# Altium schematic sheet 02_ZYNQ_CORE_POS.SchDoc
size 566 x 398 mm; SheetNumber: 2; SheetTotal: 7
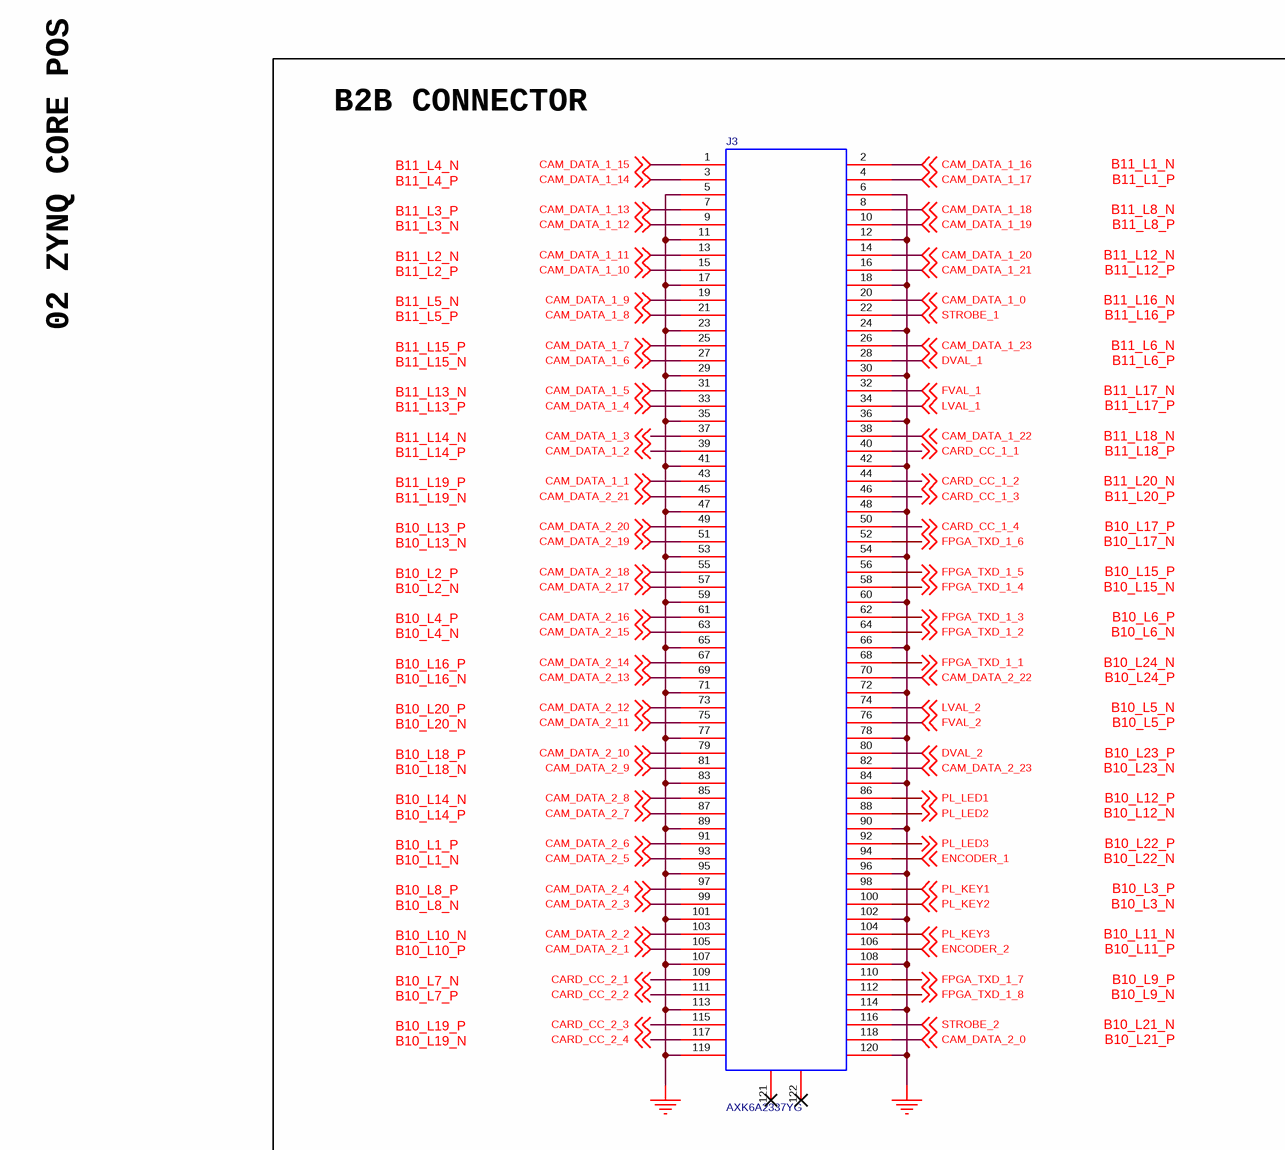
[diagram p0: 02_ZYNQ_CORE_POS.SchDoc, top left]
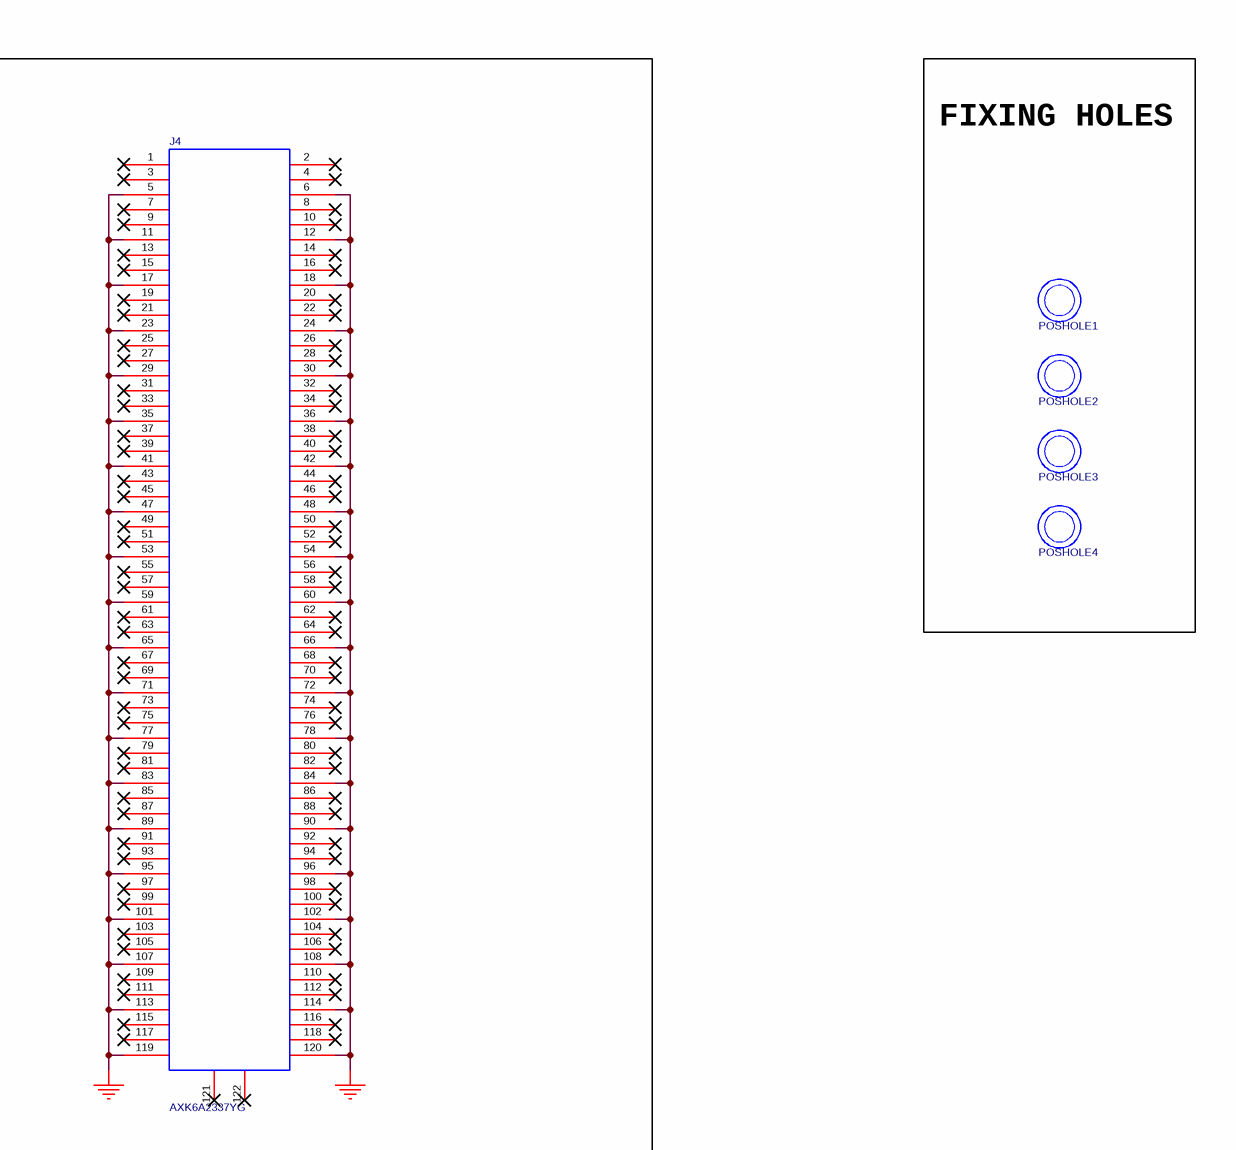
[diagram p1: 02_ZYNQ_CORE_POS.SchDoc, top right]
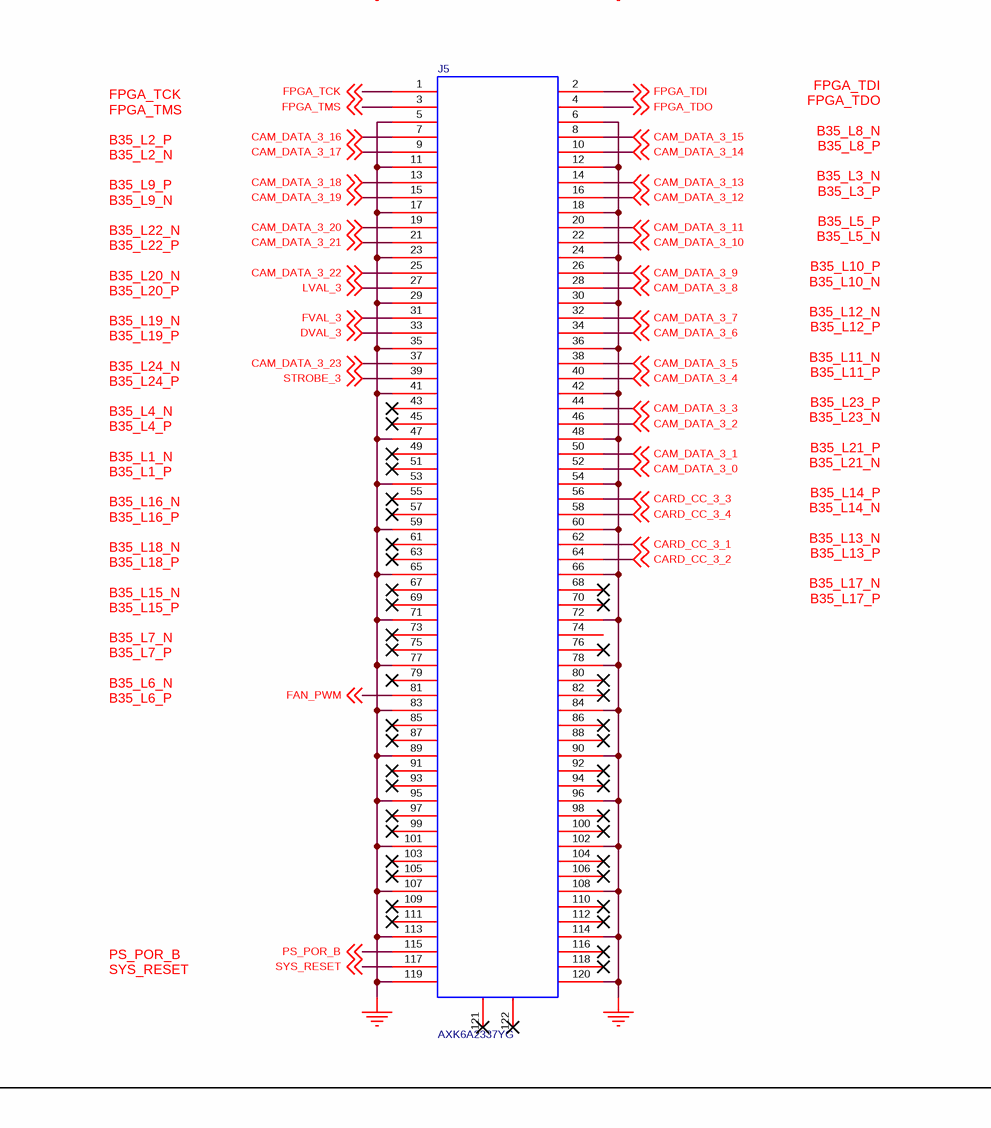
[diagram p2: 02_ZYNQ_CORE_POS.SchDoc, bottom left]
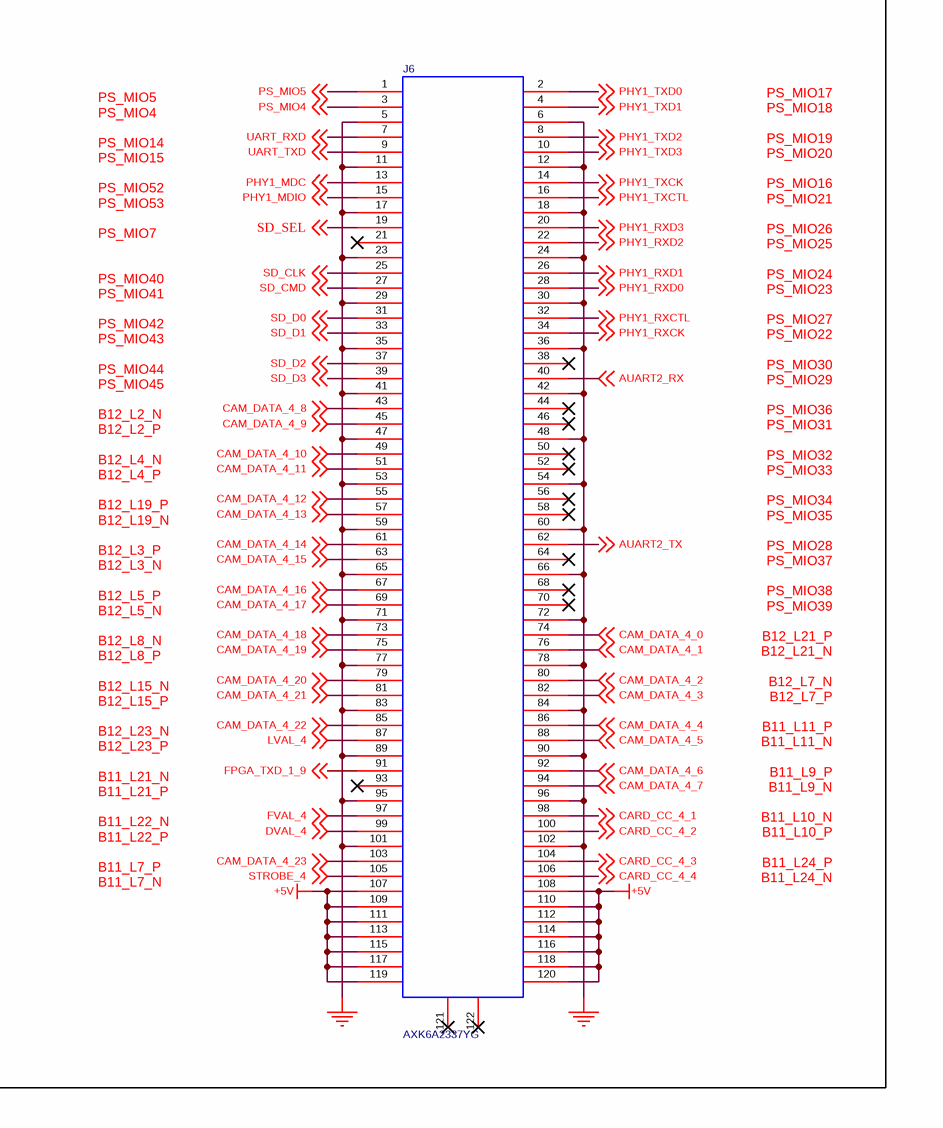
[diagram p3: 02_ZYNQ_CORE_POS.SchDoc, bottom right]

## Parts
J3  AXK6A2337YG  [AXK620337YG]
J4  AXK6A2337YG  [AXK620337YG]
J5  AXK6A2337YG  [AXK620337YG]
J6  AXK6A2337YG  [AXK620337YG]
POSHOLE1  POSHOLE  [POSHOLE-3.2]  (value not drawn)
POSHOLE2  POSHOLE  [POSHOLE-3.2]  (value not drawn)
POSHOLE3  POSHOLE  [POSHOLE-3.2]  (value not drawn)
POSHOLE4  POSHOLE  [POSHOLE-3.2]  (value not drawn)

## Blocks framed on the sheet
B2B CONNECTOR: J3-J6
FIXING HOLES: POSHOLE1-POSHOLE4

## Nets
+5V: J6.107 J6.108 J6.109 J6.110 J6.111 J6.112 J6.113 J6.114 J6.115 J6.116 J6.117 J6.118 J6.119 J6.120
GND: J3.5 J3.6 J3.11 J3.12 J3.17 J3.18 J3.23 J3.24 J3.29 J3.30 J3.35 J3.36 J3.41 J3.42 J3.47 J3.48 J3.53 J3.54 J3.59 J3.60 J3.65 J3.66 J3.71 J3.72 J3.77 J3.78 J3.83 J3.84 J3.89 J3.90 J3.95 J3.96 J3.101 J3.102 J3.107 J3.108 J3.113 J3.114 J3.119 J3.120 J4.5 J4.6 J4.11 J4.12 J4.17 J4.18 J4.23 J4.24 J4.29 J4.30 J4.35 J4.36 J4.41 J4.42 J4.47 J4.48 J4.53 J4.54 J4.59 J4.60 J4.65 J4.66 J4.71 J4.72 J4.77 J4.78 J4.83 J4.84 J4.89 J4.90 J4.95 J4.96 J4.101 J4.102 J4.107 J4.108 J4.113 J4.114 J4.119 J4.120 J5.5 J5.6 J5.11 J5.12 J5.17 J5.18 J5.23 J5.24 J5.29 J5.30 J5.35 J5.36 J5.41 J5.42 J5.47 J5.48 J5.53 J5.54 J5.59 J5.60 J5.65 J5.66 J5.71 J5.72 J5.77 J5.78 J5.83 J5.84 J5.89 J5.90 J5.95 J5.96 J5.101 J5.102 J5.107 J5.108 J5.113 J5.114 J5.119 J5.120 J6.5 J6.6 J6.11 J6.12 J6.17 J6.18 J6.23 J6.24 J6.29 J6.30 J6.35 J6.36 J6.41 J6.42 J6.47 J6.48 J6.53 J6.54 J6.59 J6.60 J6.65 J6.66 J6.71 J6.72 J6.77 J6.78 J6.83 J6.84 J6.89 J6.90 J6.95 J6.96 J6.101 J6.102
AUART2_RX: J6.40 ; off-sheet AUART2_RX
AUART2_TX: J6.62 ; off-sheet AUART2_TX
CAM_DATA_1_0: J3.20 ; off-sheet CAM_DATA_1_0
CAM_DATA_1_1: J3.43 ; off-sheet CAM_DATA_1_1
CAM_DATA_1_2: J3.39 ; off-sheet CAM_DATA_1_2
CAM_DATA_1_3: J3.37 ; off-sheet CAM_DATA_1_3
CAM_DATA_1_4: J3.33 ; off-sheet CAM_DATA_1_4
CAM_DATA_1_5: J3.31 ; off-sheet CAM_DATA_1_5
CAM_DATA_1_6: J3.27 ; off-sheet CAM_DATA_1_6
CAM_DATA_1_7: J3.25 ; off-sheet CAM_DATA_1_7
CAM_DATA_1_8: J3.21 ; off-sheet CAM_DATA_1_8
CAM_DATA_1_9: J3.19 ; off-sheet CAM_DATA_1_9
CAM_DATA_1_10: J3.15 ; off-sheet CAM_DATA_1_10
CAM_DATA_1_11: J3.13 ; off-sheet CAM_DATA_1_11
CAM_DATA_1_12: J3.9 ; off-sheet CAM_DATA_1_12
CAM_DATA_1_13: J3.7 ; off-sheet CAM_DATA_1_13
CAM_DATA_1_14: J3.3 ; off-sheet CAM_DATA_1_14
CAM_DATA_1_15: J3.1 ; off-sheet CAM_DATA_1_15
CAM_DATA_1_16: J3.2 ; off-sheet CAM_DATA_1_16
CAM_DATA_1_17: J3.4 ; off-sheet CAM_DATA_1_17
CAM_DATA_1_18: J3.8 ; off-sheet CAM_DATA_1_18
CAM_DATA_1_19: J3.10 ; off-sheet CAM_DATA_1_19
CAM_DATA_1_20: J3.14 ; off-sheet CAM_DATA_1_20
CAM_DATA_1_21: J3.16 ; off-sheet CAM_DATA_1_21
CAM_DATA_1_22: J3.38 ; off-sheet CAM_DATA_1_22
CAM_DATA_1_23: J3.26 ; off-sheet CAM_DATA_1_23
CAM_DATA_2_0: J3.118 ; off-sheet CAM_DATA_2_0
CAM_DATA_2_1: J3.105 ; off-sheet CAM_DATA_2_1
CAM_DATA_2_2: J3.103 ; off-sheet CAM_DATA_2_2
CAM_DATA_2_3: J3.99 ; off-sheet CAM_DATA_2_3
CAM_DATA_2_4: J3.97 ; off-sheet CAM_DATA_2_4
CAM_DATA_2_5: J3.93 ; off-sheet CAM_DATA_2_5
CAM_DATA_2_6: J3.91 ; off-sheet CAM_DATA_2_6
CAM_DATA_2_7: J3.87 ; off-sheet CAM_DATA_2_7
CAM_DATA_2_8: J3.85 ; off-sheet CAM_DATA_2_8
CAM_DATA_2_9: J3.81 ; off-sheet CAM_DATA_2_9
CAM_DATA_2_10: J3.79 ; off-sheet CAM_DATA_2_10
CAM_DATA_2_11: J3.75 ; off-sheet CAM_DATA_2_11
CAM_DATA_2_12: J3.73 ; off-sheet CAM_DATA_2_12
CAM_DATA_2_13: J3.69 ; off-sheet CAM_DATA_2_13
CAM_DATA_2_14: J3.67 ; off-sheet CAM_DATA_2_14
CAM_DATA_2_15: J3.63 ; off-sheet CAM_DATA_2_15
CAM_DATA_2_16: J3.61 ; off-sheet CAM_DATA_2_16
CAM_DATA_2_17: J3.57 ; off-sheet CAM_DATA_2_17
CAM_DATA_2_18: J3.55 ; off-sheet CAM_DATA_2_18
CAM_DATA_2_19: J3.51 ; off-sheet CAM_DATA_2_19
CAM_DATA_2_20: J3.49 ; off-sheet CAM_DATA_2_20
CAM_DATA_2_21: J3.45 ; off-sheet CAM_DATA_2_21
CAM_DATA_2_22: J3.70 ; off-sheet CAM_DATA_2_22
CAM_DATA_2_23: J3.82 ; off-sheet CAM_DATA_2_23
CAM_DATA_3_0: J5.52 ; off-sheet CAM_DATA_3_0
CAM_DATA_3_1: J5.50 ; off-sheet CAM_DATA_3_1
CAM_DATA_3_2: J5.46 ; off-sheet CAM_DATA_3_2
CAM_DATA_3_3: J5.44 ; off-sheet CAM_DATA_3_3
CAM_DATA_3_4: J5.40 ; off-sheet CAM_DATA_3_4
CAM_DATA_3_5: J5.38 ; off-sheet CAM_DATA_3_5
CAM_DATA_3_6: J5.34 ; off-sheet CAM_DATA_3_6
CAM_DATA_3_7: J5.32 ; off-sheet CAM_DATA_3_7
CAM_DATA_3_8: J5.28 ; off-sheet CAM_DATA_3_8
CAM_DATA_3_9: J5.26 ; off-sheet CAM_DATA_3_9
CAM_DATA_3_10: J5.22 ; off-sheet CAM_DATA_3_10
CAM_DATA_3_11: J5.20 ; off-sheet CAM_DATA_3_11
CAM_DATA_3_12: J5.16 ; off-sheet CAM_DATA_3_12
CAM_DATA_3_13: J5.14 ; off-sheet CAM_DATA_3_13
CAM_DATA_3_14: J5.10 ; off-sheet CAM_DATA_3_14
CAM_DATA_3_15: J5.8 ; off-sheet CAM_DATA_3_15
CAM_DATA_3_16: J5.7 ; off-sheet CAM_DATA_3_16
CAM_DATA_3_17: J5.9 ; off-sheet CAM_DATA_3_17
CAM_DATA_3_18: J5.13 ; off-sheet CAM_DATA_3_18
CAM_DATA_3_19: J5.15 ; off-sheet CAM_DATA_3_19
CAM_DATA_3_20: J5.19 ; off-sheet CAM_DATA_3_20
CAM_DATA_3_21: J5.21 ; off-sheet CAM_DATA_3_21
CAM_DATA_3_22: J5.25 ; off-sheet CAM_DATA_3_22
CAM_DATA_3_23: J5.37 ; off-sheet CAM_DATA_3_23
CAM_DATA_4_0: J6.74 ; off-sheet CAM_DATA_4_0
CAM_DATA_4_1: J6.76 ; off-sheet CAM_DATA_4_1
CAM_DATA_4_2: J6.80 ; off-sheet CAM_DATA_4_2
CAM_DATA_4_3: J6.82 ; off-sheet CAM_DATA_4_3
CAM_DATA_4_4: J6.86 ; off-sheet CAM_DATA_4_4
CAM_DATA_4_5: J6.88 ; off-sheet CAM_DATA_4_5
CAM_DATA_4_6: J6.92 ; off-sheet CAM_DATA_4_6
CAM_DATA_4_7: J6.94 ; off-sheet CAM_DATA_4_7
CAM_DATA_4_8: J6.43 ; off-sheet CAM_DATA_4_8
CAM_DATA_4_9: J6.45 ; off-sheet CAM_DATA_4_9
CAM_DATA_4_10: J6.49 ; off-sheet CAM_DATA_4_10
CAM_DATA_4_11: J6.51 ; off-sheet CAM_DATA_4_11
CAM_DATA_4_12: J6.55 ; off-sheet CAM_DATA_4_12
CAM_DATA_4_13: J6.57 ; off-sheet CAM_DATA_4_13
CAM_DATA_4_14: J6.61 ; off-sheet CAM_DATA_4_14
CAM_DATA_4_15: J6.63 ; off-sheet CAM_DATA_4_15
CAM_DATA_4_16: J6.67 ; off-sheet CAM_DATA_4_16
CAM_DATA_4_17: J6.69 ; off-sheet CAM_DATA_4_17
CAM_DATA_4_18: J6.73 ; off-sheet CAM_DATA_4_18
CAM_DATA_4_19: J6.75 ; off-sheet CAM_DATA_4_19
CAM_DATA_4_20: J6.79 ; off-sheet CAM_DATA_4_20
CAM_DATA_4_21: J6.81 ; off-sheet CAM_DATA_4_21
CAM_DATA_4_22: J6.85 ; off-sheet CAM_DATA_4_22
CAM_DATA_4_23: J6.103 ; off-sheet CAM_DATA_4_23
CARD_CC_1_1: J3.40 ; off-sheet CARD_CC_1_1
CARD_CC_1_2: J3.44 ; off-sheet CARD_CC_1_2
CARD_CC_1_3: J3.46 ; off-sheet CARD_CC_1_3
CARD_CC_1_4: J3.50 ; off-sheet CARD_CC_1_4
CARD_CC_2_1: J3.109 ; off-sheet CARD_CC_2_1
CARD_CC_2_2: J3.111 ; off-sheet CARD_CC_2_2
CARD_CC_2_3: J3.115 ; off-sheet CARD_CC_2_3
CARD_CC_2_4: J3.117 ; off-sheet CARD_CC_2_4
CARD_CC_3_1: J5.62 ; off-sheet CARD_CC_3_1
CARD_CC_3_2: J5.64 ; off-sheet CARD_CC_3_2
CARD_CC_3_3: J5.56 ; off-sheet CARD_CC_3_3
CARD_CC_3_4: J5.58 ; off-sheet CARD_CC_3_4
CARD_CC_4_1: J6.98 ; off-sheet CARD_CC_4_1
CARD_CC_4_2: J6.100 ; off-sheet CARD_CC_4_2
CARD_CC_4_3: J6.104 ; off-sheet CARD_CC_4_3
CARD_CC_4_4: J6.106 ; off-sheet CARD_CC_4_4
DVAL_1: J3.28 ; off-sheet DVAL_1
DVAL_2: J3.80 ; off-sheet DVAL_2
DVAL_3: J5.33 ; off-sheet DVAL_3
DVAL_4: J6.99 ; off-sheet DVAL_4
ENCODER_1: J3.94 ; off-sheet ENCODER_1
ENCODER_2: J3.106 ; off-sheet ENCODER_2
FAN_PWM: J5.81 ; off-sheet FAN_PWM
FPGA_TCK: J5.1 ; off-sheet FPGA_TCK
FPGA_TDI: J5.2 ; off-sheet FPGA_TDI
FPGA_TDO: J5.4 ; off-sheet FPGA_TDO
FPGA_TMS: J5.3 ; off-sheet FPGA_TMS
FPGA_TXD_1_1: J3.68 ; off-sheet FPGA_TXD_1_1
FPGA_TXD_1_2: J3.64 ; off-sheet FPGA_TXD_1_2
FPGA_TXD_1_3: J3.62 ; off-sheet FPGA_TXD_1_3
FPGA_TXD_1_4: J3.58 ; off-sheet FPGA_TXD_1_4
FPGA_TXD_1_5: J3.56 ; off-sheet FPGA_TXD_1_5
FPGA_TXD_1_6: J3.52 ; off-sheet FPGA_TXD_1_6
FPGA_TXD_1_7: J3.110 ; off-sheet FPGA_TXD_1_7
FPGA_TXD_1_8: J3.112 ; off-sheet FPGA_TXD_1_8
FPGA_TXD_1_9: J6.91 ; off-sheet FPGA_TXD_1_9
FVAL_1: J3.32 ; off-sheet FVAL_1
FVAL_2: J3.76 ; off-sheet FVAL_2
FVAL_3: J5.31 ; off-sheet FVAL_3
FVAL_4: J6.97 ; off-sheet FVAL_4
LVAL_1: J3.34 ; off-sheet LVAL_1
LVAL_2: J3.74 ; off-sheet LVAL_2
LVAL_3: J5.27 ; off-sheet LVAL_3
LVAL_4: J6.87 ; off-sheet LVAL_4
PHY1_MDC: J6.13 ; off-sheet PHY1_MDC
PHY1_MDIO: J6.15 ; off-sheet PHY1_MDIO
PHY1_RXCK: J6.34 ; off-sheet PHY1_RXCK
PHY1_RXCTL: J6.32 ; off-sheet PHY1_RXCTL
PHY1_RXD0: J6.28 ; off-sheet PHY1_RXD0
PHY1_RXD1: J6.26 ; off-sheet PHY1_RXD1
PHY1_RXD2: J6.22 ; off-sheet PHY1_RXD2
PHY1_RXD3: J6.20 ; off-sheet PHY1_RXD3
PHY1_TXCK: J6.14 ; off-sheet PHY1_TXCK
PHY1_TXCTL: J6.16 ; off-sheet PHY1_TXCTL
PHY1_TXD0: J6.2 ; off-sheet PHY1_TXD0
PHY1_TXD1: J6.4 ; off-sheet PHY1_TXD1
PHY1_TXD2: J6.8 ; off-sheet PHY1_TXD2
PHY1_TXD3: J6.10 ; off-sheet PHY1_TXD3
PL_KEY1: J3.98 ; off-sheet PL_KEY1
PL_KEY2: J3.100 ; off-sheet PL_KEY2
PL_KEY3: J3.104 ; off-sheet PL_KEY3
PL_LED1: J3.86 ; off-sheet PL_LED1
PL_LED2: J3.88 ; off-sheet PL_LED2
PL_LED3: J3.92 ; off-sheet PL_LED3
PS_MIO4: J6.3 ; off-sheet PS_MIO4
PS_MIO5: J6.1 ; off-sheet PS_MIO5
PS_POR_B: J5.115 ; off-sheet PS_POR_B
SD_CLK: J6.25 ; off-sheet SD_CLK
SD_CMD: J6.27 ; off-sheet SD_CMD
SD_D0: J6.31 ; off-sheet SD_D0
SD_D1: J6.33 ; off-sheet SD_D1
SD_D2: J6.37 ; off-sheet SD_D2
SD_D3: J6.39 ; off-sheet SD_D3
SD_SEL: J6.19 ; off-sheet SD_SEL
STROBE_1: J3.22 ; off-sheet STROBE_1
STROBE_2: J3.116 ; off-sheet STROBE_2
STROBE_3: J5.39 ; off-sheet STROBE_3
STROBE_4: J6.105 ; off-sheet STROBE_4
SYS_RESET: J5.117 ; off-sheet SYS_RESET
UART_RXD: J6.7 ; off-sheet UART_RXD
UART_TXD: J6.9 ; off-sheet UART_TXD

Not connected (* = marked no-connect by the designer): J3 121* 122*; J4 1* 2* 3* 4* 7* 8* 9* 10* 13* 14* 15* 16* 19* 20* 21* 22* 25* 26* 27* 28* 31* 32* 33* 34* 37* 38* 39* 40* 43* 44* 45* 46* 49* 50* 51* 52* 55* 56* 57* 58* 61* 62* 63* 64* 67* 68* 69* 70* 73* 74* 75* 76* 79* 80* 81* 82* 85* 86* 87* 88* 91* 92* 93* 94* 97* 98* 99* 100* 103* 104* 105* 106* 109* 110* 111* 112* 115* 116* 117* 118* 121* 122*; J5 43* 45* 49* 51* 55* 57* 61* 63* 67* 68* 69* 70* 73* 74 75* 76* 79* 80* 82* 85* 86* 87* 88* 91* 92* 93* 94* 97* 98* 99* 100* 103* 104* 105* 106* 109* 110* 111* 112* 116* 118* 121* 122*; J6 21* 38* 44* 46* 50* 52* 56* 58* 64* 68* 70* 93* 121* 122*

## Notes on the sheet
- 02 ZYNQ CORE POS
- B11_L1_N
  B11_L1_P
  B11_L8_N
  B11_L8_P
  B11_L12_N
  B11_L12_P
  B11_L16_N
  B11_L16_P
  B11_L6_N
  B11_L6_P
  B11_L17_N
  B11_L17_P
  B11_L18_N
  B11_L18_P
  B11_L20_N
  B11_L20_P
  B10_L17_P
  B10_L17_N
  B10_L15_P
  B10_L15_N
  B10_L6_P
  B10_L6_N
  B10_L24_N
  B10_L24_P
  B10_L5_N
  B10_L5_P
  B10_L23_P
  B10_L23_N
  B10_L12_P
  B10_L12_N
  B10_L22_P
  B10_L22_N
  B10_L3_P
  B10_L3_N
  B10_L11_N
  B10_L11_P
  B10_L9_P
  B10_L9_N
  B10_L21_N
  B10_L21_P
- B11_L4_N
  B11_L4_P
  B11_L3_P
  B11_L3_N
  B11_L2_N
  B11_L2_P
  B11_L5_N
  B11_L5_P
  B11_L15_P
  B11_L15_N
  B11_L13_N
  B11_L13_P
  B11_L14_N
  B11_L14_P
  B11_L19_P
  B11_L19_N
  B10_L13_P
  B10_L13_N
  B10_L2_P
  B10_L2_N
  B10_L4_P
  B10_L4_N
  B10_L16_P
  B10_L16_N
  B10_L20_P
  B10_L20_N
  B10_L18_P
  B10_L18_N
  B10_L14_N
  B10_L14_P
  B10_L1_P
  B10_L1_N
  B10_L8_P
  B10_L8_N
  B10_L10_N
  B10_L10_P
  B10_L7_N
  B10_L7_P
  B10_L19_P
  B10_L19_N
- FPGA_TCK
  FPGA_TMS
  B35_L2_P
  B35_L2_N
  B35_L9_P
  B35_L9_N
  B35_L22_N
  B35_L22_P
  B35_L20_N
  B35_L20_P
  B35_L19_N
  B35_L19_P
  B35_L24_N
  B35_L24_P
  B35_L4_N
  B35_L4_P
  B35_L1_N
  B35_L1_P
  B35_L16_N
  B35_L16_P
  B35_L18_N
  B35_L18_P
  B35_L15_N
  B35_L15_P
  B35_L7_N
  B35_L7_P
  B35_L6_N
  B35_L6_P
  PS_POR_B
  SYS_RESET
- FPGA_TDI
  FPGA_TDO
  B35_L8_N
  B35_L8_P
  B35_L3_N
  B35_L3_P
  B35_L5_P
  B35_L5_N
  B35_L10_P
  B35_L10_N
  B35_L12_N
  B35_L12_P
  B35_L11_N
  B35_L11_P
  B35_L23_P
  B35_L23_N
  B35_L21_P
  B35_L21_N
  B35_L14_P
  B35_L14_N
  B35_L13_N
  B35_L13_P
  B35_L17_N
  B35_L17_P
- PS_MIO5
  PS_MIO4
  PS_MIO14
  PS_MIO15
  PS_MIO52
  PS_MIO53
  PS_MIO7
  PS_MIO40
  PS_MIO41
  PS_MIO42
  PS_MIO43
  PS_MIO44
  PS_MIO45
  B12_L2_N
  B12_L2_P
  B12_L4_N
  B12_L4_P
  B12_L19_P
  B12_L19_N
  B12_L3_P
  B12_L3_N
  B12_L5_P
  B12_L5_N
  B12_L8_N
  B12_L8_P
  B12_L15_N
  B12_L15_P
  B12_L23_N
  B12_L23_P
  B11_L21_N
  B11_L21_P
  B11_L22_N
  B11_L22_P
  B11_L7_P
  B11_L7_N
- PS_MIO17
  PS_MIO18
  PS_MIO19
  PS_MIO20
  PS_MIO16
  PS_MIO21
  PS_MIO26
  PS_MIO25
  PS_MIO24
  PS_MIO23
  PS_MIO27
  PS_MIO22
  PS_MIO30
  PS_MIO29
  PS_MIO36
  PS_MIO31
  PS_MIO32
  PS_MIO33
  PS_MIO34
  PS_MIO35
  PS_MIO28
  PS_MIO37
  PS_MIO38
  PS_MIO39
  B12_L21_P
  B12_L21_N
  B12_L7_N
  B12_L7_P
  B11_L11_P
  B11_L11_N
  B11_L9_P
  B11_L9_N
  B11_L10_N
  B11_L10_P
  B11_L24_P
  B11_L24_N

## Library data of the parts
J3-J6 = 120pin